# Altium project Arc.PrjPcb
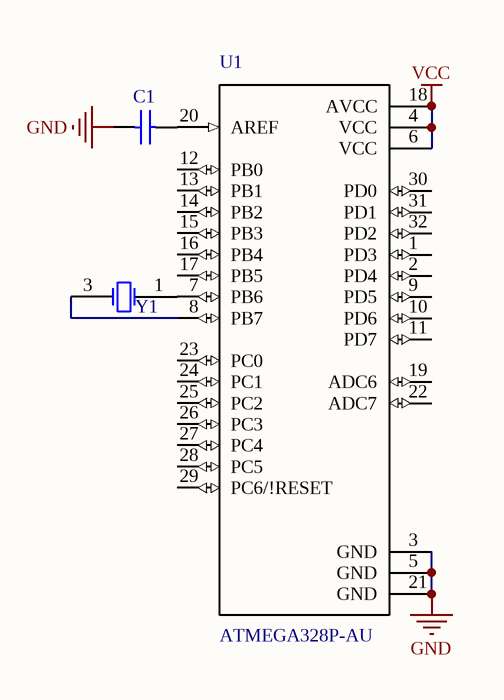
[diagram p0: Arc.SchDoc]
1 sheet, 3 parts. Net scope: global (net labels, ports and power ports of the same name join across sheets).
Board file: Arc.PcbDoc

## Sheet Arc.SchDoc
size A4

### Parts
C1  100nF (104) 10% 16V  [0402_C]  (value not drawn)
U1  ATMEGA328P-AU  [*QFP80P900X900X120-32N]
Y1  16MHZ 9PF 10PPM  [SMD-3225_4P]  (value not drawn)

### Nets
GND: C1.1 U1.3(GND) U1.5(GND) U1.21(GND)
VCC: U1.4(VCC) U1.6(VCC) U1.18(AVCC)
NetC1_2: C1.2 U1.20(AREF)
NetU1_7: U1.7(PB6) Y1.1(OSC1)
NetU1_8: U1.8(PB7) Y1.3(OSC2)

Not connected (* = marked no-connect by the designer): U1 1(PD3) 2(PD4) 9(PD5) 10(PD6) 11(PD7) 12(PB0) 13(PB1) 14(PB2) 15(PB3) 16(PB4) 17(PB5) 19(ADC6) 22(ADC7) 23(PC0) 24(PC1) 25(PC2) 26(PC3) 27(PC4) 28(PC5) 29(PC6/!RESET) 30(PD0) 31(PD1) 32(PD2)

### Library data of the parts
C1 = 0402 100nF (104) 10% 16V: 贴片电容; ComponentLink1Description: 供应商链接; ComponentLink1URL: http://www.szlcsc.com/product/details_1877.html; Package: 0402; Supplier: LC; SuppliersPartNumber: C1525
U1 = ATMEGA328P-AU: Microcontroller Mcu, 8 Bit, Atmega, 20mhz, Tqfp-32; MF: Microchip; SnapEDA_Link: https://www.snapeda.com/parts/ATMEGA328P-AU/Microchip/view-part/?ref=snap; Availability: Unavailable; Price: None; MP: ATMEGA328P-AU; Package: TQFP-32 Microchip; Value: *
Y1 = SMD-3225_4P  16MHZ 9PF 10PPM: 贴片晶振; ComponentLink1Description: 供应商链接; ComponentLink1URL: http://www.szlcsc.com/product/details_14393.html; Package: SMD-3225_4P; Supplier: LC; SuppliersPartNumber: C13738